# Altium schematic sheet Display.SchDoc
size Tabloid; DrawnBy: V-P.Rheaume@USherbrooke.ca; Organization: Universite de Sherbrooke; Address1: L3, 12a Rodborough Rd; Address2: Frenchs Forest; Address3: NSW; Address4: Australia 2086; Revision: 0; SheetNumber: 8; SheetTotal: 8; SheetName: Display
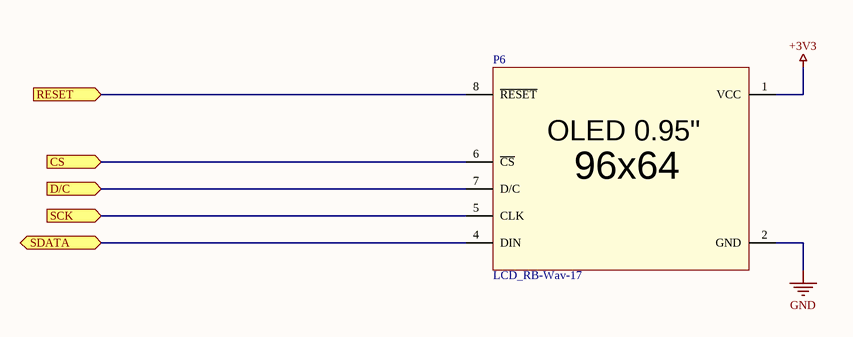
[diagram p0: Display.SchDoc]

## Parts
P6  LCD_RB-Wav-17  [LCD_RB-Wav-17]

## Ports
CS (in), D/C (in), RESET (in), SCK (in), SDATA (bidir)

## Nets
+3V3: P6.1(VCC)
GND: P6.2(GND)
CS: P6.6(~{CS}) ; port CS
D/C: P6.7(D/C) ; port D/C
RESET: P6.8(~{RESET}) ; port RESET
SCK: P6.5(CLK) ; port SCK
SDATA: P6.4(DIN) ; port SDATA

Not connected (* = marked no-connect by the designer): P6 3(NC) M(NC)

## Notes on the sheet
- Sheet name
- Project name
- Contact
- Rev
- Date
- Sheet
- of
- (in symbol LCD_RB-Wav-17) OLED 0.95"; 96x64

## Library data of the parts
P6 = LCD_RB-Wav-17: 96x64 resolution 0.95inch OLED; Mfg: Waveshare; HelpURL: *; Mfg_PN: RB-Wav-17; NI: *; Rating: *; Supplier1: Robotshop; Supplier1_PN: RB-Wav-17; Tolerance: *; Type: *; Value: *